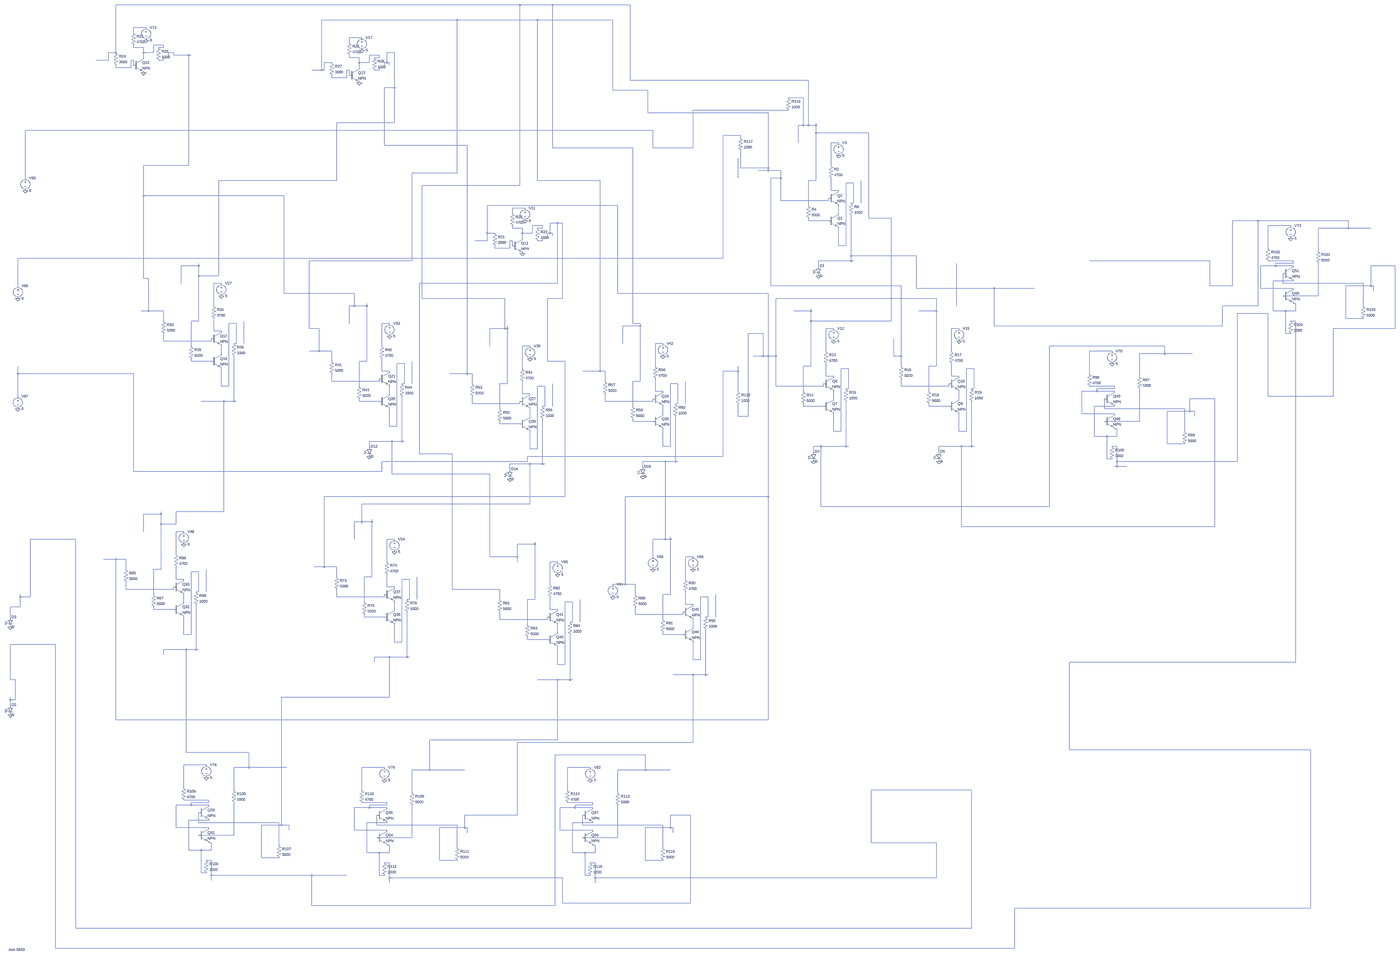
[diagram p0: schematic Draft1.asc, whole sheet]
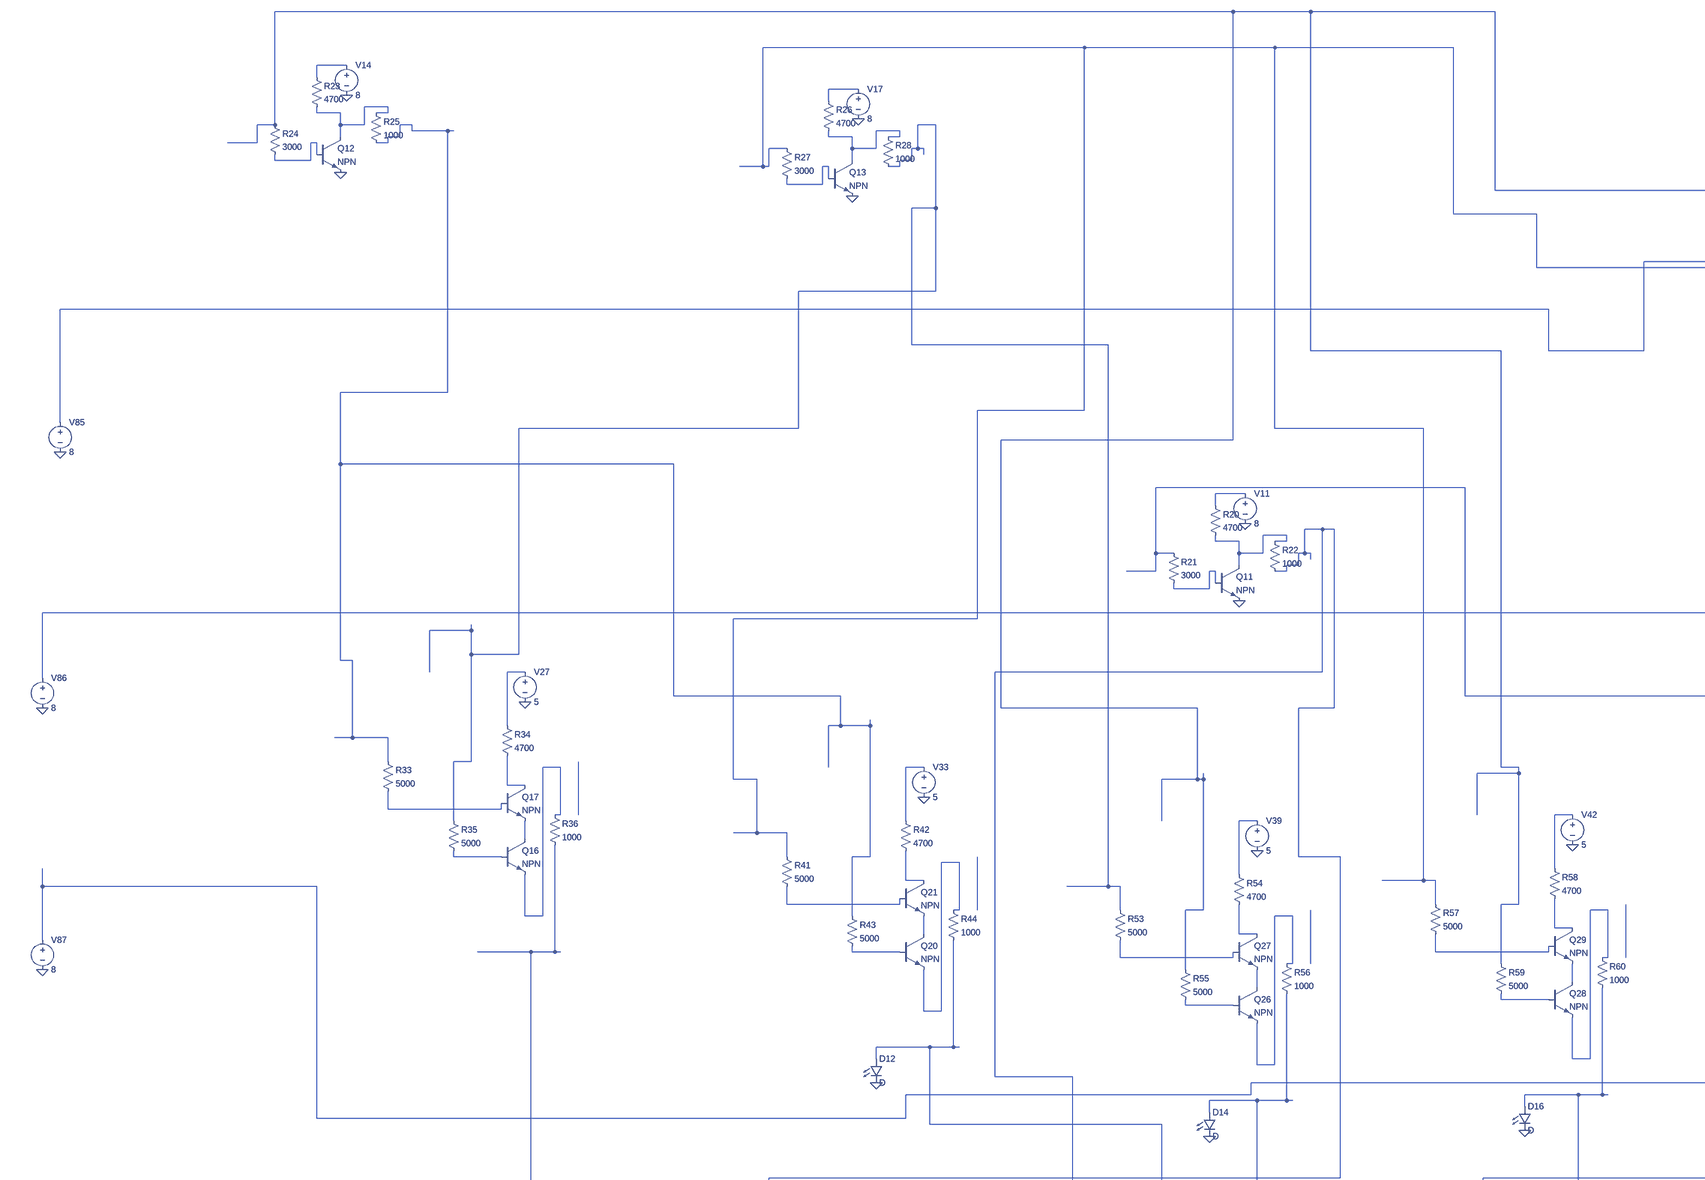
[diagram p1: schematic Draft1.asc, part, row 1 of 2, column 1 of 2]
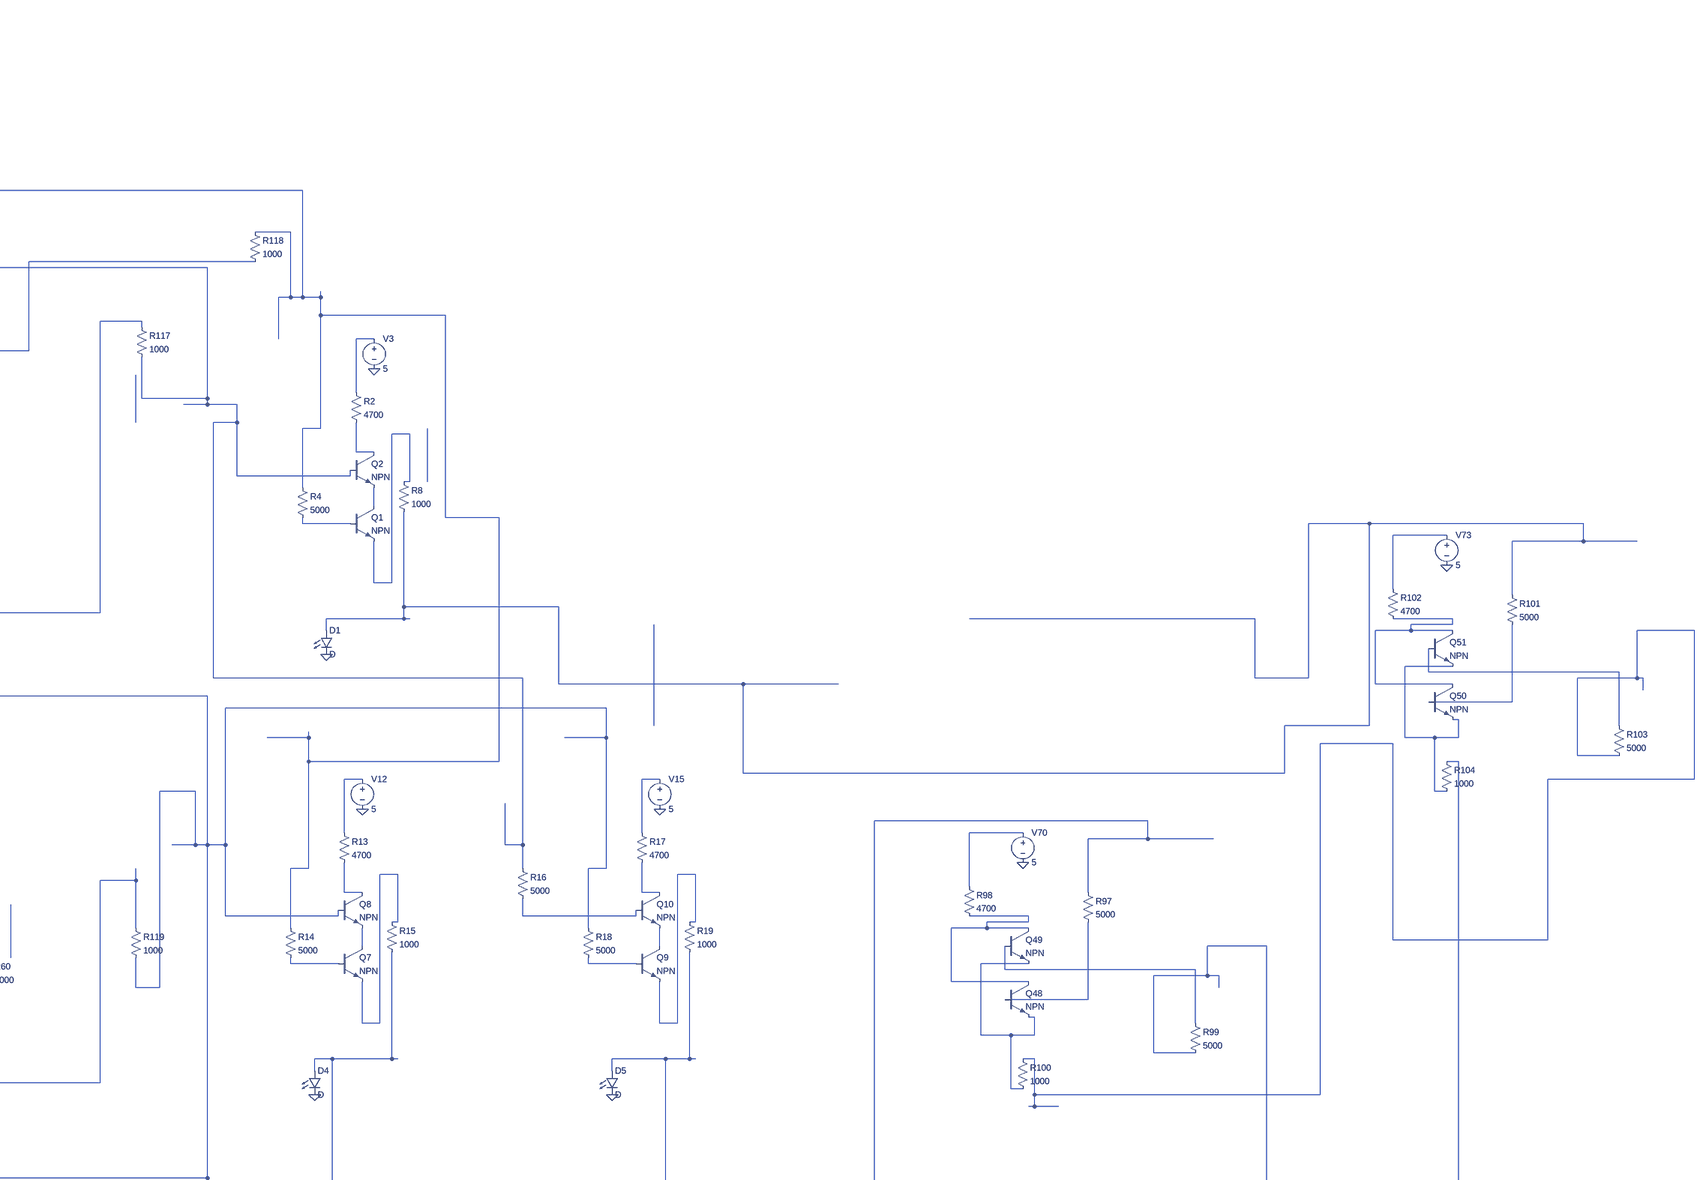
[diagram p2: schematic Draft1.asc, part, row 1 of 2, column 2 of 2]
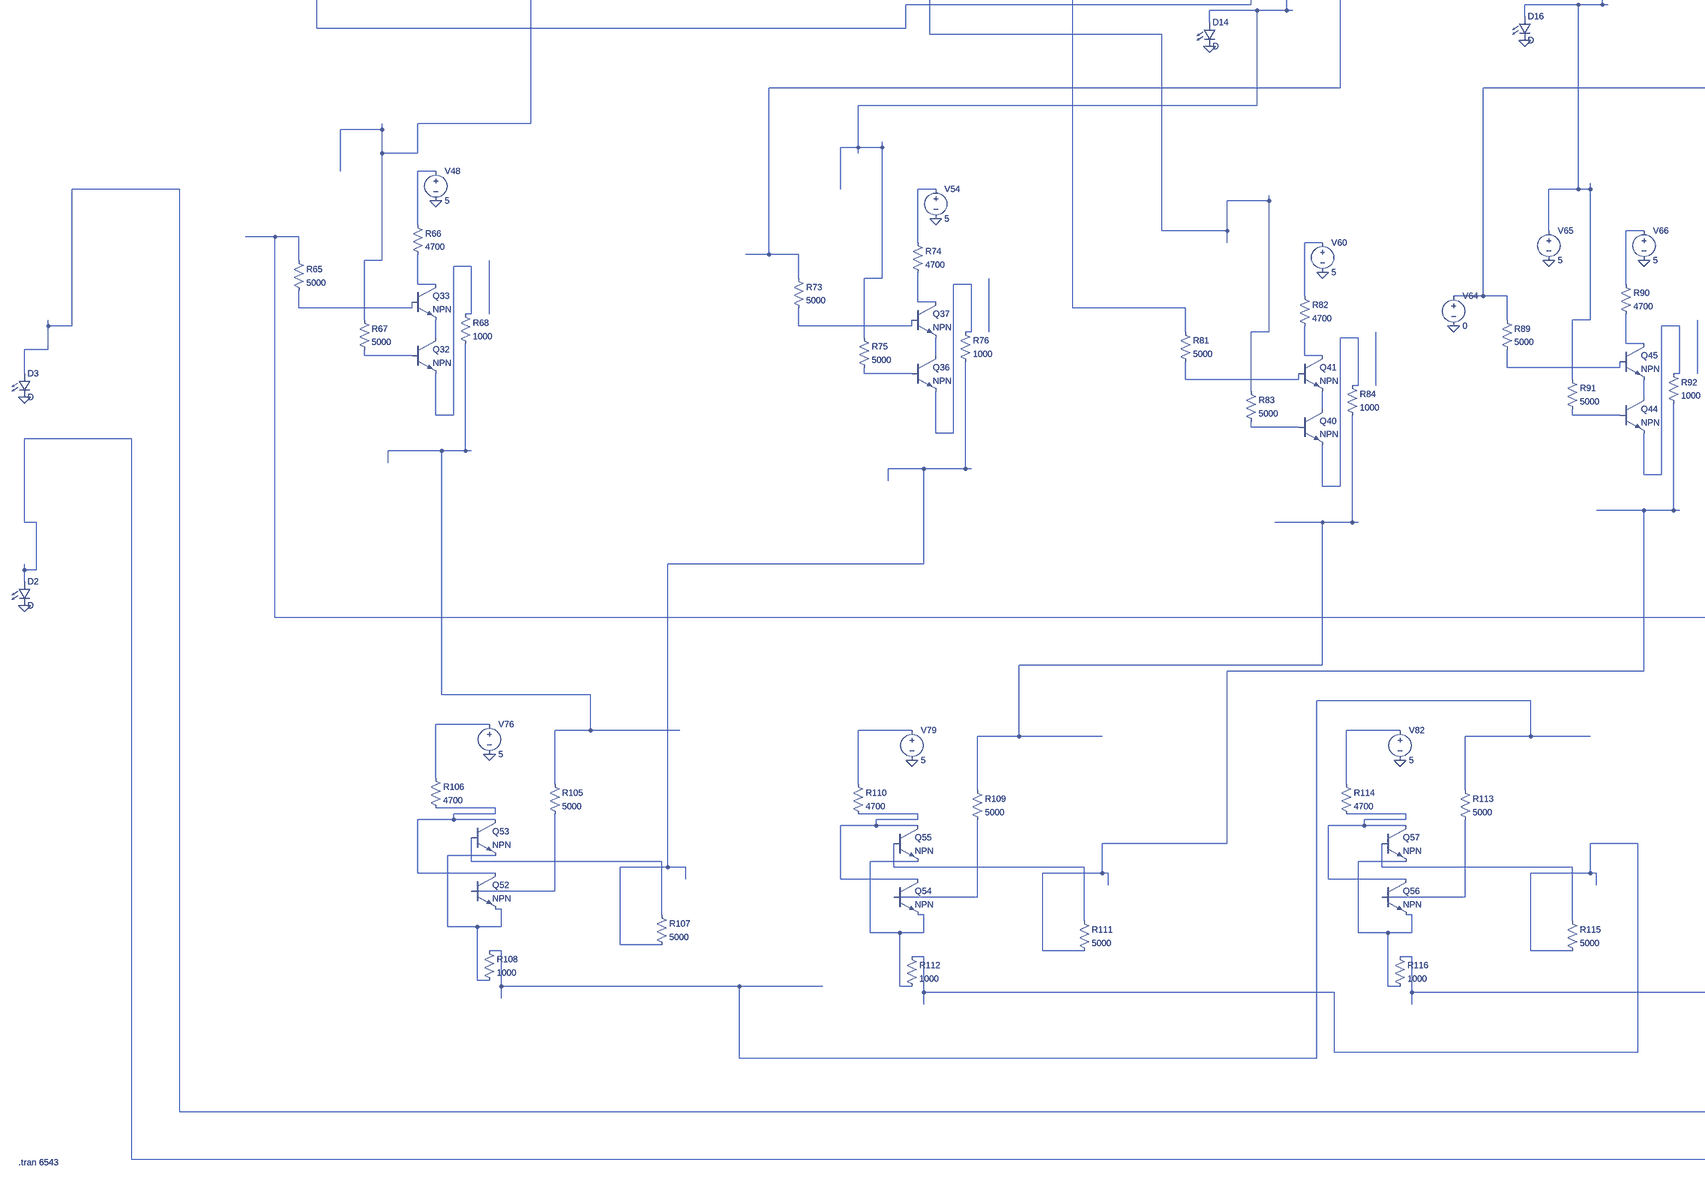
[diagram p3: schematic Draft1.asc, part, row 2 of 2, column 1 of 2]
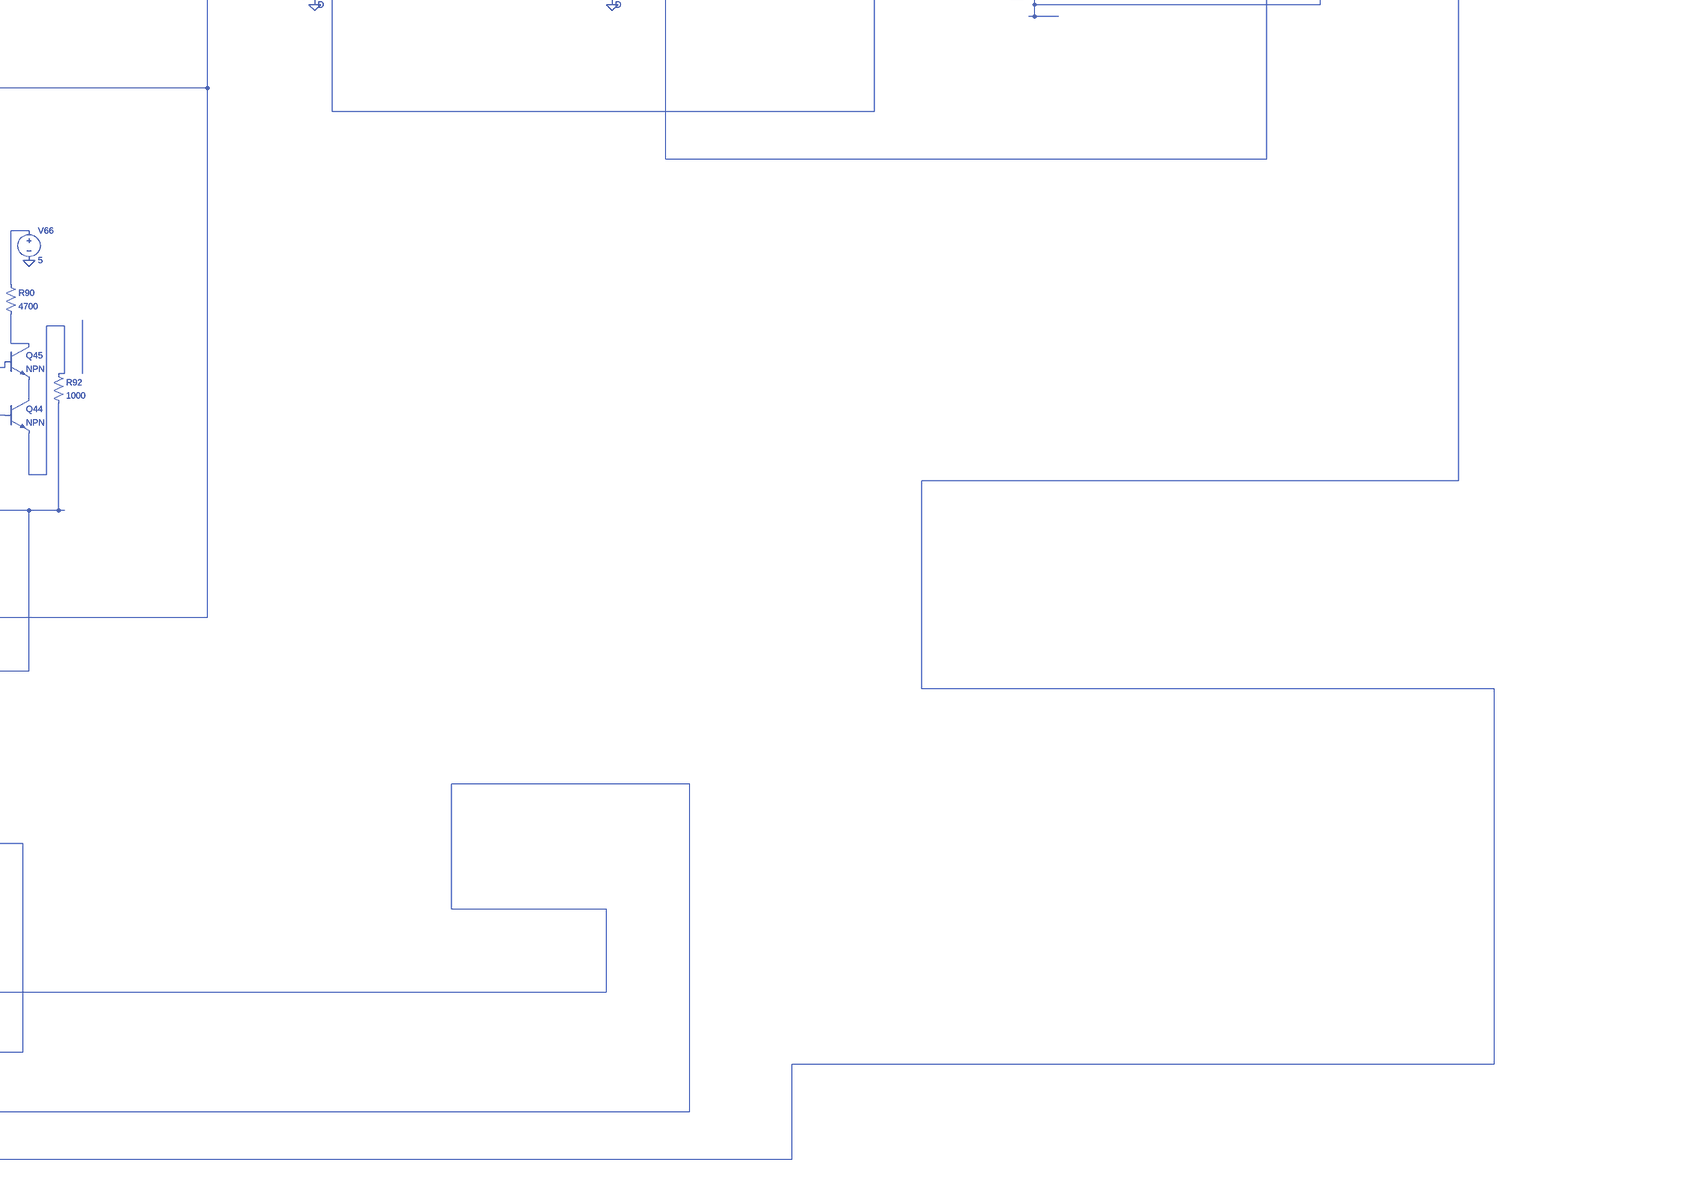
[diagram p4: schematic Draft1.asc, part, row 2 of 2, column 2 of 2]
Draft1.asc, the LTspice schematic file:
Version 4.1
SHEET 1 2884 5224
WIRE -3120 -1120 -5696 -1120
WIRE -2912 -1120 -3120 -1120
WIRE -2416 -1120 -2912 -1120
WIRE -3520 -1024 -4384 -1024
WIRE -3008 -1024 -3520 -1024
WIRE -2528 -1024 -3008 -1024
WIRE -5504 -976 -5584 -976
WIRE -5584 -944 -5584 -976
WIRE -4128 -912 -4208 -912
WIRE -4208 -880 -4208 -912
WIRE -5392 -864 -5456 -864
WIRE -5584 -848 -5584 -864
WIRE -5520 -848 -5584 -848
WIRE -5392 -848 -5392 -864
WIRE -5392 -848 -5424 -848
WIRE -5696 -816 -5696 -1120
WIRE -5696 -816 -5744 -816
WIRE -5520 -816 -5520 -848
WIRE -5456 -816 -5456 -864
WIRE -5456 -816 -5520 -816
WIRE -5328 -816 -5360 -816
WIRE -3920 -816 -3968 -816
WIRE -5328 -800 -5328 -816
WIRE -5232 -800 -5328 -800
WIRE -5216 -800 -5232 -800
WIRE -4016 -800 -4080 -800
WIRE -5520 -784 -5520 -816
WIRE -5360 -784 -5360 -816
WIRE -5360 -784 -5392 -784
WIRE -4208 -784 -4208 -800
WIRE -4144 -784 -4208 -784
WIRE -4016 -784 -4016 -800
WIRE -4016 -784 -4048 -784
WIRE -5744 -768 -5744 -816
WIRE -5744 -768 -5824 -768
WIRE -5584 -768 -5600 -768
WIRE -5392 -768 -5392 -784
WIRE -5392 -768 -5424 -768
WIRE -4320 -752 -4368 -752
WIRE -4144 -752 -4144 -784
WIRE -4080 -752 -4080 -800
WIRE -4080 -752 -4144 -752
WIRE -3968 -752 -3968 -816
WIRE -3968 -752 -3984 -752
WIRE -3952 -752 -3968 -752
WIRE -5584 -736 -5584 -768
WIRE -3952 -736 -3952 -752
WIRE -5696 -720 -5696 -736
WIRE -5600 -720 -5600 -768
WIRE -5600 -720 -5696 -720
WIRE -4144 -720 -4144 -752
WIRE -3984 -720 -3984 -752
WIRE -3984 -720 -4016 -720
WIRE -4384 -704 -4384 -1024
WIRE -4384 -704 -4448 -704
WIRE -4368 -704 -4368 -752
WIRE -4368 -704 -4384 -704
WIRE -4208 -704 -4224 -704
WIRE -4016 -704 -4016 -720
WIRE -4016 -704 -4048 -704
WIRE -4208 -672 -4208 -704
WIRE -4320 -656 -4320 -672
WIRE -4224 -656 -4224 -704
WIRE -4224 -656 -4320 -656
WIRE -2416 -640 -2416 -1120
WIRE -1280 -640 -2416 -640
WIRE -3920 -592 -3920 -816
WIRE -3920 -592 -3984 -592
WIRE -2528 -576 -2528 -1024
WIRE -2304 -576 -2528 -576
WIRE -1312 -528 -1408 -528
WIRE -1408 -448 -2016 -448
WIRE -2304 -432 -2304 -576
WIRE -1536 -432 -2304 -432
WIRE -3920 -368 -3920 -592
WIRE -3920 -368 -4288 -368
WIRE -1312 -352 -1312 -528
WIRE -1312 -352 -1344 -352
WIRE -1280 -352 -1280 -640
WIRE -1280 -352 -1312 -352
WIRE -1232 -352 -1232 -368
WIRE -1232 -352 -1280 -352
WIRE -2272 -320 -7072 -320
WIRE -1232 -304 -1232 -352
WIRE -896 -304 -1232 -304
WIRE -1712 -288 -1824 -288
WIRE -1712 -272 -1712 -288
WIRE -1344 -240 -1344 -352
WIRE -1088 -240 -1136 -240
WIRE -3984 -224 -3984 -592
WIRE -3456 -224 -3984 -224
WIRE -2912 -208 -2912 -1120
WIRE -2400 -208 -2912 -208
WIRE -2272 -208 -2272 -320
WIRE -2016 -208 -2016 -448
WIRE -2016 -208 -2272 -208
WIRE -5232 -96 -5232 -800
WIRE -5232 -96 -5520 -96
WIRE -1136 -96 -1136 -240
WIRE -1712 -80 -1712 -192
WIRE -1536 -80 -1536 -432
WIRE -1536 -80 -1712 -80
WIRE -1536 -64 -1536 -80
WIRE -1536 -64 -1600 -64
WIRE -1456 -64 -1536 -64
WIRE -3520 -48 -3520 -1024
WIRE -3520 -48 -3808 -48
WIRE -7072 -16 -7072 -320
WIRE -1728 -16 -1728 -144
WIRE -1456 -16 -1456 -64
WIRE -1456 -16 -1520 -16
WIRE -4288 0 -4288 -368
WIRE -4288 0 -5040 0
WIRE -3008 0 -3008 -1024
WIRE -2608 0 -3008 0
WIRE -1232 0 -1232 -304
WIRE -1232 0 -1280 0
WIRE -992 16 -1040 16
WIRE -3120 32 -3120 -1120
WIRE -3120 32 -3744 32
WIRE -1136 64 -1136 -16
WIRE -1088 64 -1136 64
WIRE -5520 96 -5520 -96
WIRE -4624 96 -5520 96
WIRE -1456 128 -1456 -16
WIRE -1152 128 -1152 112
WIRE -1152 128 -1456 128
WIRE -992 144 -992 16
WIRE -992 144 -1008 144
WIRE -944 144 -944 0
WIRE -2496 160 -3328 160
WIRE -1280 160 -1280 0
WIRE -3088 176 -3168 176
WIRE -3168 208 -3168 176
WIRE -1088 208 -1088 160
WIRE -896 240 -896 -304
WIRE -736 240 -896 240
WIRE -1280 256 -1280 240
WIRE -1152 256 -1280 256
WIRE 1968 256 1728 256
WIRE 2544 256 1968 256
WIRE -2880 272 -2928 272
WIRE -2848 272 -2880 272
WIRE -2976 288 -3040 288
WIRE 2176 288 2032 288
WIRE -3168 304 -3168 288
WIRE -3104 304 -3168 304
WIRE -2976 304 -2976 288
WIRE -2976 304 -3008 304
WIRE 2544 304 2544 256
WIRE 2544 304 2352 304
WIRE 2688 304 2544 304
WIRE -3328 336 -3328 160
WIRE -3280 336 -3328 336
WIRE -3104 336 -3104 304
WIRE -3040 336 -3040 288
WIRE -3040 336 -3104 336
WIRE -2928 336 -2928 272
WIRE -2928 336 -2944 336
WIRE -2912 336 -2928 336
WIRE -2912 352 -2912 336
WIRE -3104 368 -3104 336
WIRE -2944 368 -2944 336
WIRE -2944 368 -2976 368
WIRE -3328 384 -3328 336
WIRE -3328 384 -3408 384
WIRE -3168 384 -3184 384
WIRE -2976 384 -2976 368
WIRE -2976 384 -3008 384
WIRE -3168 416 -3168 384
WIRE -1088 416 -1088 304
WIRE -1040 416 -1040 16
WIRE -1040 416 -1088 416
WIRE -3280 432 -3280 416
WIRE -3184 432 -3184 384
WIRE -3184 432 -3280 432
WIRE 2032 432 2032 288
WIRE 2352 448 2352 304
WIRE -1008 480 -1008 224
WIRE -576 480 -1008 480
WIRE -1824 496 -1824 -288
WIRE -1824 496 -7120 496
WIRE -3808 512 -3808 -48
WIRE -3808 512 -4464 512
WIRE -1008 512 -1008 480
WIRE -1008 512 -1216 512
WIRE -992 512 -1008 512
WIRE 1584 512 816 512
WIRE 2192 512 2032 512
WIRE 2192 528 2192 512
WIRE 2192 528 2080 528
WIRE -5168 544 -5168 528
WIRE -5168 544 -5280 544
WIRE -1216 544 -1216 512
WIRE 2080 544 2080 528
WIRE 2080 544 1984 544
WIRE 2192 544 2080 544
WIRE 2880 544 2688 544
WIRE -5168 608 -5168 544
WIRE -5040 608 -5040 0
WIRE -5040 608 -5168 608
WIRE -5520 624 -5520 96
WIRE -5488 624 -5520 624
WIRE 2192 640 2064 640
WIRE -5280 656 -5280 544
WIRE -5024 656 -5072 656
WIRE -2880 656 -2880 272
WIRE -2880 656 -3760 656
WIRE 2128 656 2128 592
WIRE 2640 656 2128 656
WIRE -7120 672 -7120 496
WIRE -1520 672 -1520 -16
WIRE -672 672 -1520 672
WIRE 1584 672 1584 512
WIRE 1728 672 1728 256
WIRE 1728 672 1584 672
WIRE 2688 672 2688 544
WIRE 2688 672 2528 672
WIRE 2704 672 2688 672
WIRE -576 688 -576 480
WIRE -80 688 -576 688
WIRE 352 688 -80 688
WIRE 1984 688 1984 544
WIRE 2192 688 1984 688
WIRE 2704 704 2704 672
WIRE -4624 720 -4624 96
WIRE -4176 720 -4624 720
WIRE -2496 720 -2496 160
WIRE -1536 720 -2496 720
WIRE 2352 736 2352 528
WIRE 2352 736 2128 736
WIRE -3744 752 -3744 32
WIRE -3216 752 -3744 752
WIRE -2848 752 -2848 272
WIRE -2848 752 -2944 752
WIRE -448 752 -1488 752
WIRE 2208 784 2192 784
WIRE -5072 800 -5072 656
WIRE -4176 800 -4176 720
WIRE -4176 800 -4208 800
WIRE -4096 800 -4096 784
WIRE -4096 800 -4176 800
WIRE -320 800 -320 528
WIRE 1968 800 1968 256
WIRE 1968 800 1664 800
WIRE 2640 800 2640 656
WIRE -5488 832 -5488 624
WIRE -5488 832 -5536 832
WIRE -5392 832 -5488 832
WIRE -1264 832 -1264 816
WIRE -1264 832 -1376 832
WIRE -448 832 -448 752
WIRE -448 832 -560 832
WIRE 2064 832 2064 640
WIRE 2144 832 2064 832
WIRE 2208 832 2208 784
WIRE 2208 832 2144 832
WIRE 2032 848 1760 848
WIRE 2528 880 2528 672
WIRE 2640 880 2528 880
WIRE -5392 896 -5392 832
WIRE -5168 896 -5168 608
WIRE -5168 896 -5216 896
WIRE -1264 896 -1264 832
WIRE -736 896 -736 240
WIRE -736 896 -1264 896
WIRE 2208 896 2176 896
WIRE -4928 912 -4976 912
WIRE -4208 912 -4208 800
WIRE -3952 912 -4000 912
WIRE -2400 912 -2400 -208
WIRE -2352 912 -2400 912
WIRE -2352 928 -2352 912
WIRE -2352 928 -2464 928
WIRE -80 928 -80 688
WIRE 1664 928 1664 800
WIRE 1664 928 -80 928
WIRE -4464 944 -4464 512
WIRE -4400 944 -4464 944
WIRE -3216 944 -3216 752
WIRE -3216 944 -3312 944
WIRE -3200 944 -3200 928
WIRE -3200 944 -3216 944
WIRE -1120 944 -1168 944
WIRE -304 944 -352 944
WIRE 2880 944 2880 544
WIRE 2880 944 2448 944
WIRE -5072 960 -5072 880
WIRE -5024 960 -5072 960
WIRE -1568 976 -1664 976
WIRE 2144 976 2144 832
WIRE 2176 976 2144 976
WIRE -5392 1024 -5392 976
WIRE -5088 1024 -5088 1008
WIRE -5088 1024 -5392 1024
WIRE -4928 1040 -4928 912
WIRE -4928 1040 -4944 1040
WIRE -4880 1040 -4880 896
WIRE -2464 1040 -2464 928
WIRE -2208 1040 -2256 1040
WIRE -5216 1056 -5216 896
WIRE -4000 1056 -4000 912
WIRE -3312 1056 -3312 944
WIRE -3056 1056 -3104 1056
WIRE 1296 1056 448 1056
WIRE -4400 1088 -4400 944
WIRE -4400 1088 -4464 1088
WIRE -4320 1088 -4400 1088
WIRE -1168 1088 -1168 944
WIRE -352 1088 -352 944
WIRE 960 1088 816 1088
WIRE -5024 1104 -5024 1056
WIRE 1296 1104 1296 1056
WIRE 1296 1104 1136 1104
WIRE 1472 1104 1296 1104
WIRE -1568 1120 -1568 976
WIRE -1568 1120 -1632 1120
WIRE -1536 1120 -1536 720
WIRE -1536 1120 -1568 1120
WIRE -1488 1120 -1488 752
WIRE -1488 1120 -1536 1120
WIRE -720 1120 -720 1008
WIRE -672 1120 -672 672
WIRE -672 1120 -720 1120
WIRE -5216 1152 -5216 1136
WIRE -5088 1152 -5216 1152
WIRE -4320 1152 -4320 1088
WIRE -4096 1152 -4096 800
WIRE -4096 1152 -4144 1152
WIRE -2944 1152 -2944 752
WIRE -2832 1152 -2944 1152
WIRE -3856 1168 -3904 1168
WIRE -2256 1184 -2256 1040
WIRE -1264 1184 -1264 896
WIRE -1264 1184 -1312 1184
WIRE -672 1184 -672 1120
WIRE -448 1184 -448 832
WIRE -448 1184 -496 1184
WIRE -3104 1200 -3104 1056
WIRE -1024 1200 -1072 1200
WIRE -208 1200 -256 1200
WIRE -4000 1216 -4000 1136
WIRE -3952 1216 -4000 1216
WIRE -2608 1216 -2608 0
WIRE -2608 1216 -2720 1216
WIRE -2576 1216 -2608 1216
WIRE -1728 1216 -1728 1184
WIRE -1728 1216 -1824 1216
WIRE -7120 1232 -7120 1184
WIRE -5584 1232 -7120 1232
WIRE -3456 1232 -3456 -224
WIRE -3456 1232 -3568 1232
WIRE -3424 1232 -3456 1232
WIRE 816 1232 816 1088
WIRE -1168 1248 -1168 1168
WIRE -1120 1248 -1168 1248
WIRE -352 1248 -352 1168
WIRE -304 1248 -352 1248
WIRE 1136 1248 1136 1104
WIRE -4320 1280 -4320 1232
WIRE -4016 1280 -4016 1264
WIRE -4016 1280 -4320 1280
WIRE -2576 1280 -2576 1216
WIRE -2352 1280 -2352 928
WIRE -2352 1280 -2400 1280
WIRE -3856 1296 -3856 1168
WIRE -3856 1296 -3872 1296
WIRE -3808 1296 -3808 1152
WIRE -3424 1296 -3424 1232
WIRE -3200 1296 -3200 944
WIRE -3200 1296 -3248 1296
WIRE -2112 1296 -2160 1296
WIRE -5024 1312 -5024 1200
WIRE -4976 1312 -4976 912
WIRE -4976 1312 -5024 1312
WIRE -4144 1312 -4144 1152
WIRE -2960 1312 -3008 1312
WIRE -1488 1312 -1488 1120
WIRE -1184 1312 -1184 1296
WIRE -1184 1312 -1488 1312
WIRE -672 1312 -672 1264
WIRE -368 1312 -368 1296
WIRE -368 1312 -672 1312
WIRE 976 1312 816 1312
WIRE -1024 1328 -1024 1200
WIRE -1024 1328 -1040 1328
WIRE -208 1328 -208 1200
WIRE -208 1328 -224 1328
WIRE 976 1328 976 1312
WIRE 976 1328 864 1328
WIRE -2256 1344 -2256 1264
WIRE -2208 1344 -2256 1344
WIRE -1728 1344 -1728 1216
WIRE -1312 1344 -1312 1184
WIRE -496 1344 -496 1184
WIRE 864 1344 864 1328
WIRE 864 1344 768 1344
WIRE 976 1344 864 1344
WIRE -3952 1360 -3952 1312
WIRE -3104 1360 -3104 1280
WIRE -3056 1360 -3104 1360
WIRE -7120 1376 -7120 1232
WIRE 2032 1376 2032 848
WIRE 2448 1376 2448 944
WIRE 2448 1376 2032 1376
WIRE -1120 1392 -1120 1344
WIRE -304 1392 -304 1344
WIRE 1616 1392 1456 1392
WIRE -5008 1408 -5152 1408
WIRE -4944 1408 -4944 1120
WIRE -4944 1408 -5008 1408
WIRE -4928 1408 -4944 1408
WIRE -4144 1408 -4144 1392
WIRE -4016 1408 -4144 1408
WIRE -2576 1408 -2576 1360
WIRE -2272 1408 -2272 1392
WIRE -2272 1408 -2576 1408
WIRE -3424 1424 -3424 1376
WIRE -3120 1424 -3120 1408
WIRE -3120 1424 -3424 1424
WIRE -2112 1424 -2112 1296
WIRE -2112 1424 -2128 1424
WIRE -2064 1424 -2064 1280
WIRE -2960 1440 -2960 1312
WIRE -2960 1440 -2976 1440
WIRE -2912 1440 -2912 1296
WIRE -2400 1440 -2400 1280
WIRE -1312 1440 -1312 1424
WIRE -1184 1440 -1312 1440
WIRE -496 1440 -496 1424
WIRE -368 1440 -496 1440
WIRE 976 1440 848 1440
WIRE -3248 1456 -3248 1296
WIRE 912 1456 912 1392
WIRE 1424 1456 912 1456
WIRE 1456 1472 1456 1392
WIRE 1456 1472 1312 1472
WIRE 1488 1472 1456 1472
WIRE -2208 1488 -2208 1440
WIRE 768 1488 768 1344
WIRE 976 1488 768 1488
WIRE -3056 1504 -3056 1456
WIRE -1728 1504 -1728 1424
WIRE -1664 1504 -1664 976
WIRE -1664 1504 -1728 1504
WIRE 1488 1504 1488 1472
WIRE -2400 1536 -2400 1520
WIRE -2272 1536 -2400 1536
WIRE 1136 1536 1136 1328
WIRE 1136 1536 912 1536
WIRE -3248 1552 -3248 1536
WIRE -3120 1552 -3248 1552
WIRE -3952 1568 -3952 1456
WIRE -3904 1568 -3904 1168
WIRE -3904 1568 -3952 1568
WIRE 992 1584 976 1584
WIRE -1120 1600 -1120 1488
WIRE -1072 1600 -1072 1200
WIRE -1072 1600 -1120 1600
WIRE -304 1600 -304 1488
WIRE -256 1600 -256 1200
WIRE -256 1600 -304 1600
WIRE 1424 1600 1424 1456
WIRE 848 1632 848 1440
WIRE 928 1632 848 1632
WIRE 992 1632 992 1584
WIRE 992 1632 928 1632
WIRE -3936 1664 -4080 1664
WIRE -3872 1664 -3872 1376
WIRE -3872 1664 -3936 1664
WIRE -3856 1664 -3872 1664
WIRE 1312 1680 1312 1472
WIRE 1424 1680 1312 1680
WIRE -4080 1696 -4080 1664
WIRE -2208 1696 -2208 1584
WIRE -2160 1696 -2160 1296
WIRE -2160 1696 -2208 1696
WIRE -1200 1696 -1248 1696
WIRE -1040 1696 -1040 1408
WIRE -1040 1696 -1200 1696
WIRE -1024 1696 -1040 1696
WIRE -288 1696 -432 1696
WIRE -224 1696 -224 1408
WIRE -224 1696 -288 1696
WIRE -208 1696 -224 1696
WIRE 992 1696 960 1696
WIRE -3056 1712 -3056 1600
WIRE -3008 1712 -3008 1312
WIRE -3008 1712 -3056 1712
WIRE -1248 1728 -1248 1696
WIRE -432 1728 -432 1696
WIRE -3760 1744 -3760 656
WIRE -3552 1744 -3760 1744
WIRE -1824 1760 -1824 1216
WIRE -1824 1760 -3072 1760
WIRE 928 1776 928 1632
WIRE 960 1776 928 1776
WIRE -3072 1792 -3072 1760
WIRE -3072 1792 -4000 1792
WIRE -2192 1792 -2336 1792
WIRE -2128 1792 -2128 1504
WIRE -2128 1792 -2192 1792
WIRE -2112 1792 -2128 1792
WIRE 992 1792 992 1696
WIRE 1760 1792 1760 848
WIRE 1760 1792 992 1792
WIRE -3056 1808 -3184 1808
WIRE -2976 1808 -2976 1520
WIRE -2976 1808 -3056 1808
WIRE -2960 1808 -2976 1808
WIRE -2336 1824 -2336 1792
WIRE 992 1824 992 1792
WIRE 992 1824 976 1824
WIRE 1056 1824 992 1824
WIRE -3184 1840 -3184 1808
WIRE -5584 1856 -5584 1232
WIRE -4000 1856 -4000 1792
WIRE -4000 1856 -5584 1856
WIRE -3936 1872 -3936 1664
WIRE -3312 1872 -3936 1872
WIRE -2832 2016 -2832 1152
WIRE -2832 2016 -4368 2016
WIRE -1536 2016 -1536 1120
WIRE -1536 2016 -2448 2016
WIRE -3056 2064 -3056 1808
WIRE -3056 2064 -4128 2064
WIRE -1200 2080 -1200 1696
WIRE 448 2080 448 1056
WIRE 448 2080 -1200 2080
WIRE -5008 2112 -5008 1408
WIRE -5008 2112 -5312 2112
WIRE -5408 2128 -5408 2112
WIRE -5408 2128 -5520 2128
WIRE -4128 2176 -4128 2064
WIRE -4128 2176 -4176 2176
WIRE -4064 2176 -4064 2160
WIRE -4064 2176 -4128 2176
WIRE -5408 2192 -5408 2128
WIRE -5312 2192 -5312 2112
WIRE -5312 2192 -5408 2192
WIRE -4128 2192 -4128 2176
WIRE -288 2208 -288 1696
WIRE 1616 2208 1616 1392
WIRE 1616 2208 -288 2208
WIRE -5520 2240 -5520 2128
WIRE -5264 2240 -5312 2240
WIRE -6640 2288 -7040 2288
WIRE -4176 2288 -4176 2176
WIRE -3920 2288 -3968 2288
WIRE -2192 2288 -2192 1792
WIRE -2192 2288 -2272 2288
WIRE -2160 2288 -2160 2272
WIRE -2160 2288 -2192 2288
WIRE -3024 2320 -3024 2304
WIRE -3024 2320 -3136 2320
WIRE -5312 2384 -5312 2240
WIRE -3312 2400 -3312 1872
WIRE -3136 2400 -3136 2320
WIRE -3136 2400 -3312 2400
WIRE -2272 2400 -2272 2288
WIRE -2016 2400 -2064 2400
WIRE -5696 2416 -5776 2416
WIRE -5632 2416 -5696 2416
WIRE -3968 2432 -3968 2288
WIRE -3136 2432 -3136 2400
WIRE -2880 2432 -2928 2432
WIRE -4368 2464 -4368 2016
WIRE -4368 2464 -4432 2464
WIRE -4288 2464 -4368 2464
WIRE -5632 2480 -5632 2416
WIRE -5408 2480 -5408 2192
WIRE -5408 2480 -5456 2480
WIRE -5168 2496 -5216 2496
WIRE -4288 2528 -4288 2464
WIRE -4064 2528 -4064 2176
WIRE -4064 2528 -4112 2528
WIRE -5312 2544 -5312 2464
WIRE -5264 2544 -5312 2544
WIRE -3824 2544 -3872 2544
WIRE -2064 2544 -2064 2400
WIRE -2928 2576 -2928 2432
WIRE -2448 2576 -2448 2016
WIRE -2448 2576 -2528 2576
WIRE -2384 2576 -2448 2576
WIRE -3968 2592 -3968 2512
WIRE -3920 2592 -3968 2592
WIRE -5632 2608 -5632 2560
WIRE -5328 2608 -5328 2592
WIRE -5328 2608 -5632 2608
WIRE -3552 2608 -3552 1744
WIRE -3248 2608 -3552 2608
WIRE -5168 2624 -5168 2496
WIRE -5168 2624 -5184 2624
WIRE -5120 2624 -5120 2480
WIRE -5456 2640 -5456 2480
WIRE -2384 2640 -2384 2576
WIRE -2160 2640 -2160 2288
WIRE -2160 2640 -2208 2640
WIRE -7104 2656 -7104 2640
WIRE -7040 2656 -7040 2288
WIRE -7040 2656 -7104 2656
WIRE -4288 2656 -4288 2608
WIRE -3984 2656 -3984 2640
WIRE -3984 2656 -4288 2656
WIRE -1920 2656 -1968 2656
WIRE -3824 2672 -3824 2544
WIRE -3824 2672 -3840 2672
WIRE -3776 2672 -3776 2528
WIRE -3248 2672 -3248 2608
WIRE -3024 2672 -3024 2320
WIRE -3024 2672 -3072 2672
WIRE -5264 2688 -5264 2640
WIRE -4112 2688 -4112 2528
WIRE -2784 2688 -2832 2688
WIRE -2064 2704 -2064 2624
WIRE -2016 2704 -2064 2704
WIRE -7104 2720 -7104 2656
WIRE -7104 2720 -7168 2720
WIRE -5456 2736 -5456 2720
WIRE -5328 2736 -5456 2736
WIRE -3920 2736 -3920 2688
WIRE -2928 2736 -2928 2656
WIRE -2880 2736 -2928 2736
WIRE -2384 2768 -2384 2720
WIRE -2080 2768 -2080 2752
WIRE -2080 2768 -2384 2768
WIRE -7168 2784 -7168 2720
WIRE -4112 2784 -4112 2768
WIRE -3984 2784 -4112 2784
WIRE -1920 2784 -1920 2656
WIRE -1920 2784 -1936 2784
WIRE -1872 2784 -1872 2640
WIRE -3248 2800 -3248 2752
WIRE -2944 2800 -2944 2784
WIRE -2944 2800 -3248 2800
WIRE -2208 2800 -2208 2640
WIRE -2784 2816 -2784 2688
WIRE -2784 2816 -2800 2816
WIRE -2736 2816 -2736 2672
WIRE -3072 2832 -3072 2672
WIRE -2016 2848 -2016 2800
WIRE -2880 2880 -2880 2832
WIRE -5264 2896 -5264 2784
WIRE -5216 2896 -5216 2496
WIRE -5216 2896 -5264 2896
WIRE -2208 2896 -2208 2880
WIRE -2080 2896 -2208 2896
WIRE -3072 2928 -3072 2912
WIRE -2944 2928 -3072 2928
WIRE -3920 2944 -3920 2832
WIRE -3872 2944 -3872 2544
WIRE -3872 2944 -3920 2944
WIRE -6864 2960 -7168 2960
WIRE -5248 2992 -5392 2992
WIRE -5184 2992 -5184 2704
WIRE -5184 2992 -5248 2992
WIRE -5168 2992 -5184 2992
WIRE -5392 3024 -5392 2992
WIRE -3952 3040 -4048 3040
WIRE -3840 3040 -3840 2752
WIRE -3840 3040 -3952 3040
WIRE -3824 3040 -3840 3040
WIRE -2016 3056 -2016 2944
WIRE -1968 3056 -1968 2656
WIRE -1968 3056 -2016 3056
WIRE -4048 3072 -4048 3040
WIRE 2208 3072 2208 896
WIRE 2208 3072 688 3072
WIRE -2880 3088 -2880 2976
WIRE -2832 3088 -2832 2688
WIRE -2832 3088 -2880 3088
WIRE -2016 3152 -2144 3152
WIRE -1936 3152 -1936 2864
WIRE -1936 3152 -2016 3152
WIRE -1920 3152 -1936 3152
WIRE -7168 3184 -7168 2960
WIRE -7136 3184 -7168 3184
WIRE -2880 3184 -3008 3184
WIRE -2800 3184 -2800 2896
WIRE -2800 3184 -2880 3184
WIRE -2784 3184 -2800 3184
WIRE -3952 3296 -3952 3040
WIRE -3952 3296 -4640 3296
WIRE -7168 3312 -7168 3296
WIRE -7136 3312 -7136 3184
WIRE -7136 3312 -7168 3312
WIRE -7168 3344 -7168 3312
WIRE -5696 3440 -5696 2416
WIRE -1536 3440 -1536 2016
WIRE -1536 3440 -5696 3440
WIRE -2880 3568 -2880 3184
WIRE -2880 3568 -3696 3568
WIRE -2016 3584 -2016 3152
WIRE -2016 3584 -3136 3584
WIRE 688 3632 688 3072
WIRE 2304 3632 688 3632
WIRE -5248 3648 -5248 2992
WIRE -4848 3648 -5248 3648
WIRE -2320 3664 -2896 3664
WIRE -5120 3728 -5264 3728
WIRE -4848 3744 -4848 3648
WIRE -4848 3744 -4944 3744
WIRE -4608 3744 -4848 3744
WIRE -3984 3744 -4128 3744
WIRE -2672 3744 -2816 3744
WIRE -3696 3760 -3696 3568
WIRE -3696 3760 -3808 3760
WIRE -3472 3760 -3696 3760
WIRE -2320 3760 -2320 3664
WIRE -2320 3760 -2496 3760
WIRE -2160 3760 -2320 3760
WIRE -5264 3872 -5264 3728
WIRE -4944 3888 -4944 3744
WIRE -4128 3888 -4128 3744
WIRE -2816 3888 -2816 3744
WIRE -224 3888 -880 3888
WIRE -3808 3904 -3808 3760
WIRE -2496 3904 -2496 3760
WIRE -5104 3952 -5264 3952
WIRE -5104 3968 -5104 3952
WIRE -5104 3968 -5216 3968
WIRE -3968 3968 -4128 3968
WIRE -2656 3968 -2816 3968
WIRE -5216 3984 -5216 3968
WIRE -5216 3984 -5312 3984
WIRE -5104 3984 -5216 3984
WIRE -3968 3984 -3968 3968
WIRE -3968 3984 -4080 3984
WIRE -2656 3984 -2656 3968
WIRE -2656 3984 -2768 3984
WIRE -4080 4000 -4080 3984
WIRE -4080 4000 -4176 4000
WIRE -3968 4000 -4080 4000
WIRE -2768 4000 -2768 3984
WIRE -2768 4000 -2864 4000
WIRE -2656 4000 -2768 4000
WIRE -3136 4048 -3136 3584
WIRE -3136 4048 -3472 4048
WIRE -2032 4048 -2160 4048
WIRE -5104 4080 -5232 4080
WIRE -5168 4096 -5168 4032
WIRE -4656 4096 -5168 4096
WIRE -3968 4096 -4096 4096
WIRE -2656 4096 -2784 4096
WIRE -4640 4112 -4640 3296
WIRE -4640 4112 -4768 4112
WIRE -4592 4112 -4640 4112
WIRE -4032 4112 -4032 4048
WIRE -3520 4112 -4032 4112
WIRE -2720 4112 -2720 4048
WIRE -2208 4112 -2720 4112
WIRE -5312 4128 -5312 3984
WIRE -5104 4128 -5312 4128
WIRE -3472 4128 -3472 4048
WIRE -3472 4128 -3632 4128
WIRE -3456 4128 -3472 4128
WIRE -2160 4128 -2160 4048
WIRE -2160 4128 -2320 4128
WIRE -2144 4128 -2160 4128
WIRE -4592 4144 -4592 4112
WIRE -4176 4144 -4176 4000
WIRE -3968 4144 -4176 4144
WIRE -2864 4144 -2864 4000
WIRE -2656 4144 -2864 4144
WIRE -3456 4160 -3456 4128
WIRE -2144 4160 -2144 4128
WIRE -4944 4176 -4944 3968
WIRE -4944 4176 -5168 4176
WIRE -3808 4192 -3808 3984
WIRE -3808 4192 -4032 4192
WIRE -2496 4192 -2496 3984
WIRE -2496 4192 -2720 4192
WIRE -5088 4224 -5104 4224
WIRE -880 4224 -880 3888
WIRE -448 4224 -880 4224
WIRE -4656 4240 -4656 4096
WIRE -3952 4240 -3968 4240
WIRE -2640 4240 -2656 4240
WIRE -3520 4256 -3520 4112
WIRE -2208 4256 -2208 4112
WIRE -5232 4272 -5232 4080
WIRE -5152 4272 -5232 4272
WIRE -5088 4272 -5088 4224
WIRE -5088 4272 -5152 4272
WIRE -4096 4288 -4096 4096
WIRE -4016 4288 -4096 4288
WIRE -3952 4288 -3952 4240
WIRE -3952 4288 -4016 4288
WIRE -2784 4288 -2784 4096
WIRE -2704 4288 -2784 4288
WIRE -2640 4288 -2640 4240
WIRE -2640 4288 -2704 4288
WIRE -4768 4320 -4768 4112
WIRE -4656 4320 -4768 4320
WIRE -5088 4336 -5120 4336
WIRE -3632 4336 -3632 4128
WIRE -3520 4336 -3632 4336
WIRE -2320 4336 -2320 4128
WIRE -2208 4336 -2320 4336
WIRE -3952 4352 -3984 4352
WIRE -2640 4352 -2672 4352
WIRE -5152 4416 -5152 4272
WIRE -5120 4416 -5152 4416
WIRE -5088 4432 -5088 4336
WIRE -4448 4432 -5088 4432
WIRE -4224 4432 -4448 4432
WIRE -4016 4432 -4016 4288
WIRE -3984 4432 -4016 4432
WIRE -2704 4432 -2704 4288
WIRE -2672 4432 -2704 4432
WIRE -3952 4448 -3952 4352
WIRE -2848 4448 -3952 4448
WIRE -2640 4448 -2640 4352
WIRE -448 4448 -448 4224
WIRE -448 4448 -2640 4448
WIRE -5088 4464 -5088 4432
WIRE -3952 4480 -3952 4448
WIRE -2640 4480 -2640 4448
WIRE -2848 4688 -2848 4448
WIRE -2032 4688 -2032 4048
WIRE -2032 4688 -2848 4688
WIRE -4448 4704 -4448 4432
WIRE -2896 4704 -2896 3664
WIRE -2896 4704 -4448 4704
WIRE 2304 4720 2304 3632
WIRE 2304 4720 192 4720
WIRE -6640 4864 -6640 2288
WIRE -224 4864 -224 3888
WIRE -224 4864 -6640 4864
WIRE -6864 5200 -6864 2960
WIRE 192 5200 192 4720
WIRE 192 5200 -6864 5200
FLAG -1088 -160 0
FLAG -1216 608 0
FLAG -1120 1024 0
FLAG -1248 1792 0
FLAG -304 1024 0
FLAG -432 1792 0
FLAG -3088 256 0
FLAG -3104 464 0
FLAG -5504 -896 0
FLAG -5520 -688 0
FLAG -4128 -832 0
FLAG -4144 -624 0
FLAG -5024 736 0
FLAG -3952 992 0
FLAG -4080 1760 0
FLAG -3056 1136 0
FLAG -3184 1904 0
FLAG -2208 1120 0
FLAG -2336 1888 0
FLAG -5264 2320 0
FLAG -3920 2368 0
FLAG -2880 2512 0
FLAG -2528 2656 0
FLAG -2272 2480 0
FLAG -2016 2480 0
FLAG 960 1168 0
FLAG 2176 368 0
FLAG -5120 3808 0
FLAG -3984 3824 0
FLAG -2672 3824 0
FLAG -7072 64 0
FLAG -7120 752 0
FLAG -7120 1456 0
FLAG -7168 2848 0
FLAG -7168 3408 0
SYMBOL voltage -1088 -256 R0
WINDOW 123 0 0 Left 0
WINDOW 39 0 0 Left 0
SYMATTR InstName V3
SYMATTR Value 5
SYMBOL res -1152 -112 R0
SYMATTR InstName R2
SYMATTR Value 4700
SYMBOL res -1296 144 R0
SYMATTR InstName R4
SYMATTR Value 5000
SYMBOL npn -1152 208 R0
SYMATTR InstName Q1
SYMBOL npn -1152 64 R0
SYMATTR InstName Q2
SYMBOL LED -1232 544 R0
SYMATTR InstName D1
SYMBOL res -1024 128 R0
SYMATTR InstName R8
SYMATTR Value 1000
SYMBOL voltage -1120 928 R0
WINDOW 123 0 0 Left 0
WINDOW 39 0 0 Left 0
SYMATTR InstName V12
SYMATTR Value 5
SYMBOL res -1184 1072 R0
SYMATTR InstName R13
SYMATTR Value 4700
SYMBOL res -1328 1328 R0
SYMATTR InstName R14
SYMATTR Value 5000
SYMBOL npn -1184 1392 R0
SYMATTR InstName Q7
SYMBOL npn -1184 1248 R0
SYMATTR InstName Q8
SYMBOL LED -1264 1728 R0
SYMATTR InstName D4
SYMBOL res -1056 1312 R0
SYMATTR InstName R15
SYMATTR Value 1000
SYMBOL voltage -304 928 R0
WINDOW 123 0 0 Left 0
WINDOW 39 0 0 Left 0
SYMATTR InstName V15
SYMATTR Value 5
SYMBOL res -688 1168 R0
SYMATTR InstName R16
SYMATTR Value 5000
SYMBOL res -368 1072 R0
SYMATTR InstName R17
SYMATTR Value 4700
SYMBOL res -512 1328 R0
SYMATTR InstName R18
SYMATTR Value 5000
SYMBOL npn -368 1392 R0
SYMATTR InstName Q9
SYMBOL npn -368 1248 R0
SYMATTR InstName Q10
SYMBOL LED -448 1728 R0
SYMATTR InstName D5
SYMBOL res -240 1312 R0
SYMATTR InstName R19
SYMATTR Value 1000
SYMBOL npn -3168 368 R0
SYMATTR InstName Q11
SYMBOL voltage -3088 160 R0
SYMATTR InstName V11
SYMATTR Value 8
SYMBOL res -3184 192 R0
SYMATTR InstName R20
SYMATTR Value 4700
SYMBOL res -3296 320 R0
SYMATTR InstName R21
SYMATTR Value 3000
SYMBOL res -3024 288 R0
SYMATTR InstName R22
SYMATTR Value 1000
SYMBOL npn -5584 -784 R0
SYMATTR InstName Q12
SYMBOL voltage -5504 -992 R0
SYMATTR InstName V14
SYMATTR Value 8
SYMBOL res -5600 -960 R0
SYMATTR InstName R23
SYMATTR Value 4700
SYMBOL res -5712 -832 R0
SYMATTR InstName R24
SYMATTR Value 3000
SYMBOL res -5440 -864 R0
SYMATTR InstName R25
SYMATTR Value 1000
SYMBOL npn -4208 -720 R0
SYMATTR InstName Q13
SYMBOL voltage -4128 -928 R0
SYMATTR InstName V17
SYMATTR Value 8
SYMBOL res -4224 -896 R0
SYMATTR InstName R26
SYMATTR Value 4700
SYMBOL res -4336 -768 R0
SYMATTR InstName R27
SYMATTR Value 3000
SYMBOL res -4064 -800 R0
SYMATTR InstName R28
SYMATTR Value 1000
SYMBOL res -5408 880 R0
SYMATTR InstName R33
SYMATTR Value 5000
SYMBOL res -5088 784 R0
SYMATTR InstName R34
SYMATTR Value 4700
SYMBOL res -5232 1040 R0
SYMATTR InstName R35
SYMATTR Value 5000
SYMBOL npn -5088 1104 R0
SYMATTR InstName Q16
SYMBOL npn -5088 960 R0
SYMATTR InstName Q17
SYMBOL res -4960 1024 R0
SYMATTR InstName R36
SYMATTR Value 1000
SYMBOL voltage -5024 640 R0
WINDOW 123 0 0 Left 0
WINDOW 39 0 0 Left 0
SYMATTR InstName V27
SYMATTR Value 5
SYMBOL res -4336 1136 R0
SYMATTR InstName R41
SYMATTR Value 5000
SYMBOL res -4016 1040 R0
SYMATTR InstName R42
SYMATTR Value 4700
SYMBOL res -4160 1296 R0
SYMATTR InstName R43
SYMATTR Value 5000
SYMBOL npn -4016 1360 R0
SYMATTR InstName Q20
SYMBOL npn -4016 1216 R0
SYMATTR InstName Q21
SYMBOL LED -4096 1696 R0
SYMATTR InstName D12
SYMBOL res -3888 1280 R0
SYMATTR InstName R44
SYMATTR Value 1000
SYMBOL voltage -3952 896 R0
WINDOW 123 0 0 Left 0
WINDOW 39 0 0 Left 0
SYMATTR InstName V33
SYMATTR Value 5
SYMBOL LED -3200 1840 R0
SYMATTR InstName D14
SYMBOL voltage -3056 1040 R0
WINDOW 123 0 0 Left 0
WINDOW 39 0 0 Left 0
SYMATTR InstName V39
SYMATTR Value 5
SYMBOL res -3440 1280 R0
SYMATTR InstName R53
SYMATTR Value 5000
SYMBOL res -3120 1184 R0
SYMATTR InstName R54
SYMATTR Value 4700
SYMBOL res -3264 1440 R0
SYMATTR InstName R55
SYMATTR Value 5000
SYMBOL npn -3120 1504 R0
SYMATTR InstName Q26
SYMBOL npn -3120 1360 R0
SYMATTR InstName Q27
SYMBOL res -2992 1424 R0
SYMATTR InstName R56
SYMATTR Value 1000
SYMBOL voltage -2208 1024 R0
WINDOW 123 0 0 Left 0
WINDOW 39 0 0 Left 0
SYMATTR InstName V42
SYMATTR Value 5
SYMBOL res -2592 1264 R0
SYMATTR InstName R57
SYMATTR Value 5000
SYMBOL res -2272 1168 R0
SYMATTR InstName R58
SYMATTR Value 4700
SYMBOL res -2416 1424 R0
SYMATTR InstName R59
SYMATTR Value 5000
SYMBOL npn -2272 1488 R0
SYMATTR InstName Q28
SYMBOL npn -2272 1344 R0
SYMATTR InstName Q29
SYMBOL LED -2352 1824 R0
SYMATTR InstName D16
SYMBOL res -2144 1408 R0
SYMATTR InstName R60
SYMATTR Value 1000
SYMBOL voltage -5264 2224 R0
WINDOW 123 0 0 Left 0
WINDOW 39 0 0 Left 0
SYMATTR InstName V48
SYMATTR Value 5
SYMBOL res -5648 2464 R0
SYMATTR InstName R65
SYMATTR Value 5000
SYMBOL res -5328 2368 R0
SYMATTR InstName R66
SYMATTR Value 4700
SYMBOL res -5472 2624 R0
SYMATTR InstName R67
SYMATTR Value 5000
SYMBOL npn -5328 2688 R0
SYMATTR InstName Q32
SYMBOL npn -5328 2544 R0
SYMATTR InstName Q33
SYMBOL res -5200 2608 R0
SYMATTR InstName R68
SYMATTR Value 1000
SYMBOL voltage -3920 2272 R0
WINDOW 123 0 0 Left 0
WINDOW 39 0 0 Left 0
SYMATTR InstName V54
SYMATTR Value 5
SYMBOL res -4304 2512 R0
SYMATTR InstName R73
SYMATTR Value 5000
SYMBOL res -3984 2416 R0
SYMATTR InstName R74
SYMATTR Value 4700
SYMBOL res -4128 2672 R0
SYMATTR InstName R75
SYMATTR Value 5000
SYMBOL npn -3984 2736 R0
SYMATTR InstName Q36
SYMBOL npn -3984 2592 R0
SYMATTR InstName Q37
SYMBOL res -3856 2656 R0
SYMATTR InstName R76
SYMATTR Value 1000
SYMBOL voltage -2880 2416 R0
WINDOW 123 0 0 Left 0
WINDOW 39 0 0 Left 0
SYMATTR InstName V60
SYMATTR Value 5
SYMBOL res -3264 2656 R0
SYMATTR InstName R81
SYMATTR Value 5000
SYMBOL res -2944 2560 R0
SYMATTR InstName R82
SYMATTR Value 4700
SYMBOL res -3088 2816 R0
SYMATTR InstName R83
SYMATTR Value 5000
SYMBOL npn -2944 2880 R0
SYMATTR InstName Q40
SYMBOL npn -2944 2736 R0
SYMATTR InstName Q41
SYMBOL res -2816 2800 R0
SYMATTR InstName R84
SYMATTR Value 1000
SYMBOL voltage -2528 2560 R0
WINDOW 123 0 0 Left 0
WINDOW 39 0 0 Left 0
SYMATTR InstName V64
SYMATTR Value 0
SYMBOL voltage -2272 2384 R0
WINDOW 123 0 0 Left 0
WINDOW 39 0 0 Left 0
SYMATTR InstName V65
SYMATTR Value 5
SYMBOL voltage -2016 2384 R0
WINDOW 123 0 0 Left 0
WINDOW 39 0 0 Left 0
SYMATTR InstName V66
SYMATTR Value 5
SYMBOL res -2400 2624 R0
SYMATTR InstName R89
SYMATTR Value 5000
SYMBOL res -2080 2528 R0
SYMATTR InstName R90
SYMATTR Value 4700
SYMBOL res -2224 2784 R0
SYMATTR InstName R91
SYMATTR Value 5000
SYMBOL npn -2080 2848 R0
SYMATTR InstName Q44
SYMBOL npn -2080 2704 R0
SYMATTR InstName Q45
SYMBOL res -1952 2768 R0
SYMATTR InstName R92
SYMATTR Value 1000
SYMBOL voltage 960 1072 R0
WINDOW 123 0 0 Left 0
WINDOW 39 0 0 Left 0
SYMATTR InstName V70
SYMATTR Value 5
SYMBOL res 1120 1232 R0
SYMATTR InstName R97
SYMATTR Value 5000
SYMBOL res 800 1216 R0
SYMATTR InstName R98
SYMATTR Value 4700
SYMBOL res 1408 1584 R0
SYMATTR InstName R99
SYMATTR Value 5000
SYMBOL npn 912 1488 R0
SYMATTR InstName Q48
SYMBOL npn 912 1344 R0
SYMATTR InstName Q49
SYMBOL res 944 1680 R0
SYMATTR InstName R100
SYMATTR Value 1000
SYMBOL voltage 2176 272 R0
WINDOW 123 0 0 Left 0
WINDOW 39 0 0 Left 0
SYMATTR InstName V73
SYMATTR Value 5
SYMBOL res 2336 432 R0
SYMATTR InstName R101
SYMATTR Value 5000
SYMBOL res 2016 416 R0
SYMATTR InstName R102
SYMATTR Value 4700
SYMBOL res 2624 784 R0
SYMATTR InstName R103
SYMATTR Value 5000
SYMBOL npn 2128 688 R0
SYMATTR InstName Q50
SYMBOL npn 2128 544 R0
SYMATTR InstName Q51
SYMBOL res 2160 880 R0
SYMATTR InstName R104
SYMATTR Value 1000
SYMBOL voltage -5120 3712 R0
WINDOW 123 0 0 Left 0
WINDOW 39 0 0 Left 0
SYMATTR InstName V76
SYMATTR Value 5
SYMBOL res -4960 3872 R0
SYMATTR InstName R105
SYMATTR Value 5000
SYMBOL res -5280 3856 R0
SYMATTR InstName R106
SYMATTR Value 4700
SYMBOL res -4672 4224 R0
SYMATTR InstName R107
SYMATTR Value 5000
SYMBOL npn -5168 4128 R0
SYMATTR InstName Q52
SYMBOL npn -5168 3984 R0
SYMATTR InstName Q53
SYMBOL res -5136 4320 R0
SYMATTR InstName R108
SYMATTR Value 1000
SYMBOL voltage -3984 3728 R0
WINDOW 123 0 0 Left 0
WINDOW 39 0 0 Left 0
SYMATTR InstName V79
SYMATTR Value 5
SYMBOL res -3824 3888 R0
SYMATTR InstName R109
SYMATTR Value 5000
SYMBOL res -4144 3872 R0
SYMATTR InstName R110
SYMATTR Value 4700
SYMBOL res -3536 4240 R0
SYMATTR InstName R111
SYMATTR Value 5000
SYMBOL npn -4032 4144 R0
SYMATTR InstName Q54
SYMBOL npn -4032 4000 R0
SYMATTR InstName Q55
SYMBOL res -4000 4336 R0
SYMATTR InstName R112
SYMATTR Value 1000
SYMBOL voltage -2672 3728 R0
WINDOW 123 0 0 Left 0
WINDOW 39 0 0 Left 0
SYMATTR InstName V82
SYMATTR Value 5
SYMBOL res -2512 3888 R0
SYMATTR InstName R113
SYMATTR Value 5000
SYMBOL res -2832 3872 R0
SYMATTR InstName R114
SYMATTR Value 4700
SYMBOL res -2224 4240 R0
SYMATTR InstName R115
SYMATTR Value 5000
SYMBOL npn -2720 4144 R0
SYMATTR InstName Q56
SYMBOL npn -2720 4000 R0
SYMATTR InstName Q57
SYMBOL res -2688 4336 R0
SYMATTR InstName R116
SYMATTR Value 1000
SYMBOL voltage -7072 -32 R0
SYMATTR InstName V85
SYMATTR Value 8
SYMBOL voltage -7120 656 R0
SYMATTR InstName V86
SYMATTR Value 8
SYMBOL voltage -7120 1360 R0
SYMATTR InstName V87
SYMATTR Value 8
SYMBOL res -1728 -288 R0
SYMATTR InstName R117
SYMATTR Value 1000
SYMBOL res -1424 -544 R0
SYMATTR InstName R118
SYMATTR Value 1000
SYMBOL res -1744 1328 R0
SYMATTR InstName R119
SYMATTR Value 1000
SYMBOL LED -7184 3344 R0
SYMATTR InstName D2
SYMBOL LED -7184 2784 R0
SYMATTR InstName D3
TEXT -7184 5208 Left 2 !.tran 6543

The netlist it stands for:
* Draft1.asc
V3 N013 0 5
R2 N013 N016 4700
R4 N001 N021 5000
Q1 N020 N021 N015 0 NPN
Q2 N016 N002 N020 0 NPN
D1 N022 0 D
R8 N015 N022 1000
V12 N037 0 5
R13 N037 N053 4700
R14 N001 N073 5000
Q7 N064 N073 N049 0 NPN
Q8 N053 N018 N064 0 NPN
D4 N044 0 D
R15 N049 N044 1000
V15 N038 0 5
R16 N002 N059 5000
R17 N038 N054 4700
R18 N018 N074 5000
Q9 N065 N074 N050 0 NPN
Q10 N054 N059 N065 0 NPN
D5 N066 0 D
R19 N050 N066 1000
Q11 N024 N026 0 0 NPN
V11 N019 0 8
R20 N019 N024 4700
R21 N018 N026 3000
R22 N024 N023 1000
Q12 N005 N009 0 0 NPN
V14 N003 0 8
R23 N003 N005 4700
R24 N001 N009 3000
R25 N005 N006 1000
Q13 N008 N010 0 0 NPN
V17 N004 0 8
R26 N004 N008 4700
R27 N002 N010 3000
R28 N008 N007 1000
R33 N006 N040 5000
R34 N030 N039 4700
R35 N007 N047 5000
Q16 N046 N047 N035 0 NPN
Q17 N039 N040 N046 0 NPN
R36 N035 N067 1000
V27 N030 0 5
R41 N002 N055 5000
R42 N036 N051 4700
R43 N006 N068 5000
Q20 N062 N068 N048 0 NPN
Q21 N051 N055 N062 0 NPN
D12 N082 0 D
R44 N048 N082 1000
V33 N036 0 5
D14 N084 0 D
V39 N043 0 5
R53 N007 N070 5000
R54 N043 N063 4700
R55 N001 N081 5000
Q26 N078 N081 N058 0 NPN
Q27 N063 N070 N078 0 NPN
R56 N058 N084 1000
V42 N042 0 5
R57 N002 N069 5000
R58 N042 N061 4700
R59 N001 N079 5000
Q28 N077 N079 N057 0 NPN
Q29 N061 N069 N077 0 NPN
D16 N083 0 D
R60 N057 N083 1000
V48 N085 0 5
R65 N018 N094 5000
R66 N085 N091 4700
R67 N067 N102 5000
Q32 N099 N102 N090 0 NPN
Q33 N091 N094 N099 0 NPN
R68 N090 N114 1000
V54 N087 0 5
R73 N023 N096 5000
R74 N087 N093 4700
R75 N084 N106 5000
Q36 N103 N106 N092 0 NPN
Q37 N093 N096 N103 0 NPN
R76 N092 N115 1000
V60 N089 0 5
R81 N023 N108 5000
R82 N089 N104 4700
R83 N082 N113 5000
Q40 N111 N113 N100 0 NPN
Q41 N104 N108 N111 0 NPN
R84 N100 N117 1000
V64 N018 0 0
V65 N083 0 5
V66 N088 0 5
R89 N018 N105 5000
R90 N088 N101 4700
R91 N083 N112 5000
Q44 N110 N112 N097 0 NPN
Q45 N101 N105 N110 0 NPN
R92 N097 N116 1000
V70 N045 0 5
R97 N044 N080 5000
R98 N045 N060 4700
R99 N076 N066 5000
Q48 N060 N080 N075 0 NPN
Q49 N060 N076 N075 0 NPN
R100 N028 N075 1000
V73 N025 0 5
R101 N022 N032 5000
R102 N025 N027 4700
R103 N031 N028 5000
Q50 N027 N032 N029 0 NPN
Q51 N027 N031 N029 0 NPN
R104 N034 N029 1000
V76 N119 0 5
R105 N114 N132 5000
R106 N119 N122 4700
R107 N127 N115 5000
Q52 N122 N132 N126 0 NPN
Q53 N122 N127 N126 0 NPN
R108 N118 N126 1000
V79 N120 0 5
R109 N117 N133 5000
R110 N120 N123 4700
R111 N130 N116 5000
Q54 N123 N133 N128 0 NPN
Q55 N123 N130 N128 0 NPN
R112 N125 N128 1000
V82 N121 0 5
R113 N118 N134 5000
R114 N121 N124 4700
R115 N131 N125 5000
Q56 N124 N134 N129 0 NPN
Q57 N124 N131 N129 0 NPN
R116 N086 N129 1000
V85 N011 0 8
V86 N012 0 8
V87 N052 0 8
R117 N012 N002 1000
R118 N001 N011 1000
R119 N052 N018 1000
D2 N034 0 D
D3 N086 0 D
.model D D
.lib standard.dio
.model NPN NPN
.model PNP PNP
.lib standard.bjt
.tran 6543
.backanno
.end